# EasyEDA Pro project 鲲FOC无刷电机控制器.epro, schematic 磁编码器板
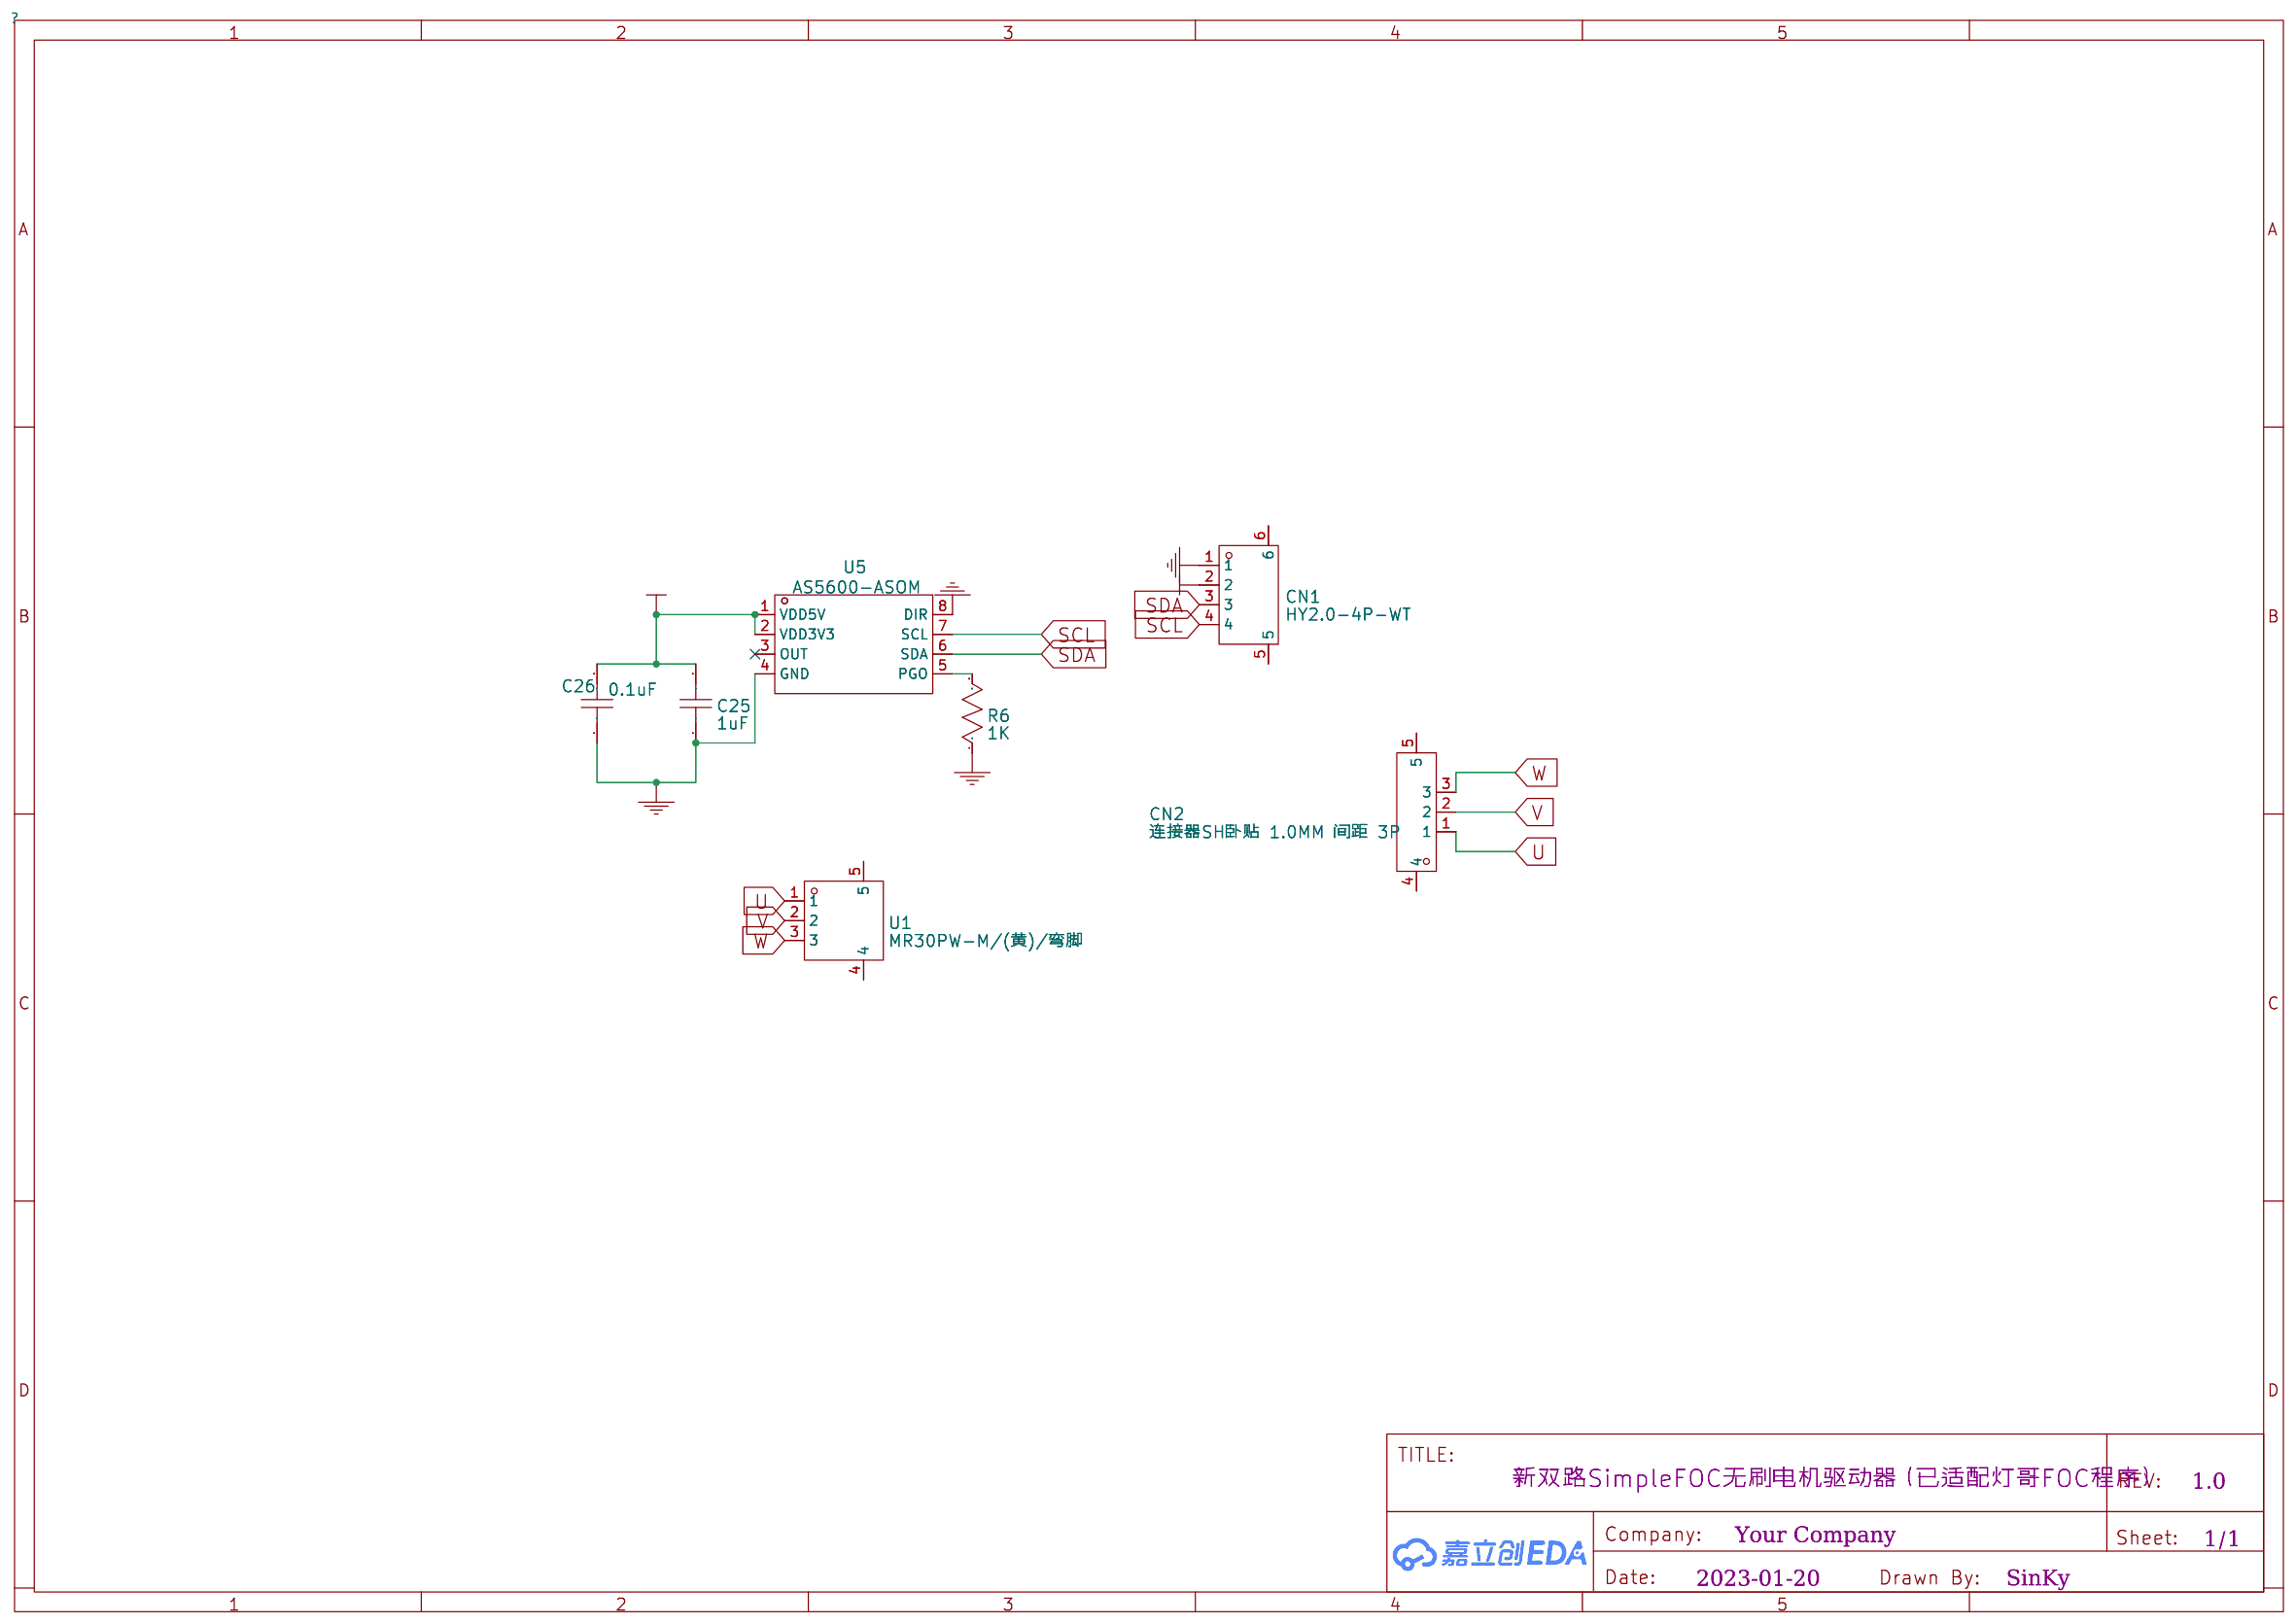
[diagram p0: schematic sheet]

## Parts
C25  1uF  [C0402_NEW]
C26  0.1uF  [C0402_NEW]
CN1  HY2.0-4P-WT  [CONN-SMD_HY2.0-4P]
CN2  连接器SH卧贴 1.0MM 间距 3P  [CONN-SMD_3P-P1.00_WAFER-SH1.0-3PWB]
R6  1K  [R0402]
U1  MR30PW-M/(黄)/弯脚  [CONN-TH_MR30PW-M]
U5  AS5600-ASOM  [SOIC-8_L5.0-W4.0-P1.27-LS6.0-BL]

## Library data of the parts
C25 = 1uF
C26 = 0.1uF
CN1 = HY2.0-4P-WT: Supplier: LCSC; Supplier Part: C722729; Manufacturer: CAX(创都); link: https://atta.szlcsc.com/upload/public/pdf/source/20200903/C722727_BBF50559C2ABBA609D4F52DD7C381BF6.pdf; JLCPCB Part Class: Extended Part
CN2 = 连接器SH卧贴 1.0mm 间距 3P: Supplier: LCSC; Supplier Part: C9900022975; Manufacturer: null
R6 = 1K
U1 = MR30PW-M/(黄)/弯脚: Supplier: LCSC; Supplier Part: C9900011214; Manufacturer: null; link: https://atta.szlcsc.comnull; JLCPCB Part Class: Extended Part
U5 = AS5600-ASOM: Supplier: LCSC; Manufacturer: Ams; Supplier Part: C79815; JLCPCB Part Class: Extend

## Nets
+3.3V: C25.2 C26.2 CN1.2 U5.1(VDD5V) U5.2(VDD3V3)
GND: C25.1 C26.1 CN1.1 R6.1 U5.4(GND) U5.8(DIR)
SCL: CN1.4 U5.7(SCL)
SDA: CN1.3 U5.6(SDA)
U: CN2.1 U1.1
V: CN2.2 U1.2
W: CN2.3 U1.3
Net-(R6-2): R6.2 U5.5(PGO)

Not connected (* = marked no-connect by the designer): CN1 5 6; CN2 4 5; U1 4 5; U5 3(OUT)*
